# Altium schematic sheet Power.SchDoc: H-Watch Power
size A3; DrawnBy: schuluka; Organization: ETH-PBL; DocumentNumber: SCH3V0.2; Revision: V0.2; SheetNumber: 3; SheetTotal: 5
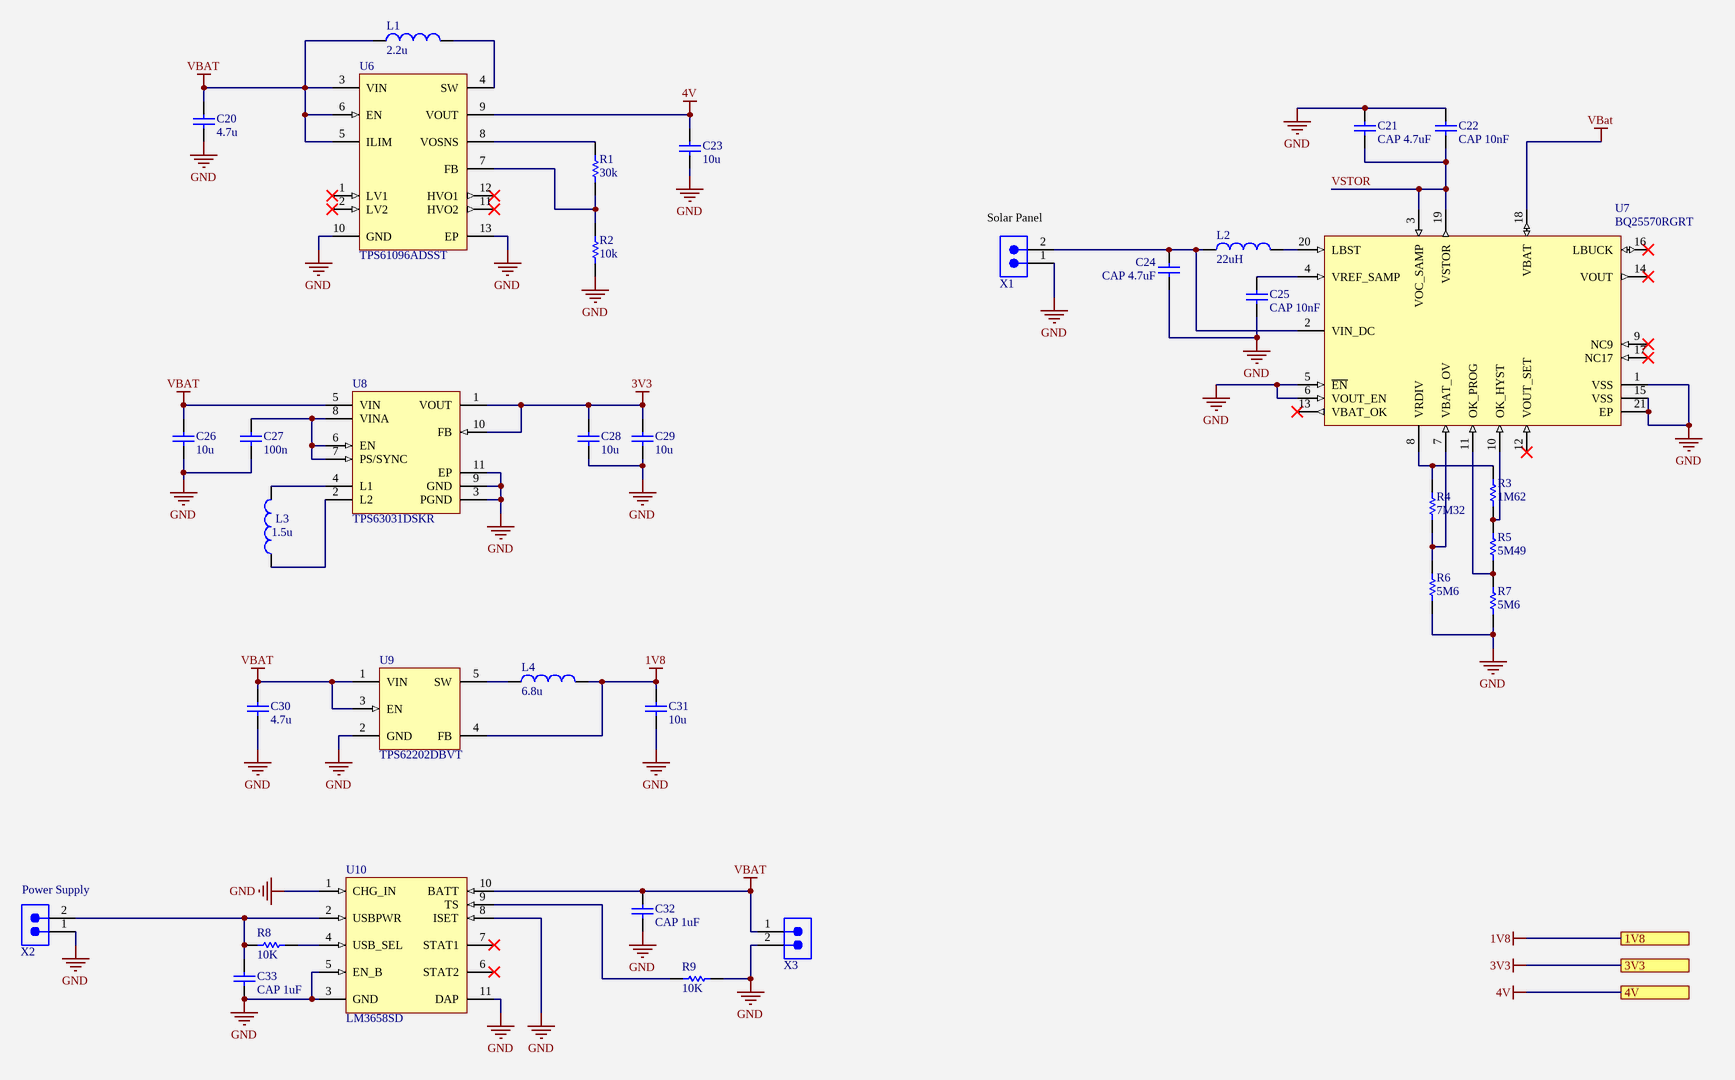
[diagram p0: Power.SchDoc]

## Parts
C20  4.7u  [CAPC1608X90X20ML10]
C21  CAP 4.7uF  [CAPC0603(1608)100_L]
C22  CAP 10nF  [CAPC0603(1608)100_L]
C23  10u  [CAPC1608X90X35NL10T15]
C24  CAP 4.7uF  [CAPC0603(1608)100_L]
C25  CAP 10nF  [CAPC0603(1608)100_L]
C26  10u  [CAPC1608X90X35NL10T15]
C27  100n  [CAPC1005X60X30ML05T10]
C28  10u  [CAPC1608X90X35NL10T15]
C29  10u  [CAPC1608X90X35NL10T15]
C30  4.7u  [CAPC1608X90X20ML10]
C31  10u  [CAPC1608X90X35NL10T15]
C32  CAP 1uF  [CAPC0603(1608)100_L]
C33  CAP 1uF  [CAPC0603(1608)100_L]
L1  2.2u  [INDC2013X140X50LL20T20]
L2  value 22uH  [INDC1210(3225)X27_L]  (hidden comment: CBC3225T220MR)
L3  1.5u  [COILCRAFT-IND-LPS3015]
L4  6.8u  [SUMI-CDRH5D28_V]
R1  30k  [RESC1005X40X25ML05T05]
R2  10k  [RESC1005X40X25LL05T05]
R3  1M62  [RESC0603(1608)_L]
R4  7M32  [RESC0603(1608)_L]
R5  5M49  [RESC0603(1608)_L]
R6  5M6  [RESC0603(1608)_L]
R7  5M6  [RESC0603(1608)_L]
R8  10K  [RESC0603(1608)_L]
R9  10K  [RESC0603(1608)_L]
U6  TPS61096ADSST  [SON50P200X80_HS-13N]
U7  BQ25570RGRT  [QFN50P350X350X100_HS-21L]
U8  TPS63031DSKR  [DSK10-2000X1200TP_V]
U9  TPS62202DBVT  [Z5+1_N]
U10  LM3658SD  [SDA10A]
X1  GRPB012VWVN-RC  [Pin Header, 1x2, TH]  (value not drawn)
X2  GRPB012VWVN-RC  [Pin Header, 1x2, TH]  (value not drawn)
X3  GRPB012VWVN-RC  [Pin Header, 1x2, TH]  (value not drawn)

## Ports
1V8, 3V3, 4V

## Nets
1V8: C31.2 L4.2 U9.4(FB) ; port 1V8
3V3: C28.2 C29.2 U8.1(VOUT) U8.10(FB) ; port 3V3
4V: C23.2 U6.9(VOUT) ; port 4V
GND: C20.1 C21.2 C22.2 C23.1 C24.1 C25.1 C26.1 C27.1 C28.1 C29.1 C30.1 C31.1 C32.1 C33.1 R2.1 R6.1 R7.1 R9.2 U6.10(GND) U6.13(EP) U7.1(VSS) U7.5(~{EN}) U7.6(VOUT_EN) U7.15(VSS) U7.21(EP) U8.3(PGND) U8.9(GND) U8.11(EP) U9.2(GND) U10.1(CHG_IN) U10.3(GND) U10.5(EN_B) U10.8(ISET) U10.11(DAP) X1.1 X2.1 X3.2
VBAT: C20.2 C26.2 C30.2 C32.2 L1.1 U6.3(VIN) U6.5(ILIM) U6.6(EN) U7.18(VBAT) U8.5(VIN) U9.1(VIN) U9.3(EN) U10.10(BATT) X3.1
VSTOR: C21.1 C22.1 U7.3(VOC_SAMP) U7.19(VSTOR)
NetC24_2: C24.2 L2.1 U7.2(VIN_DC) X1.2
NetC25_2: C25.2 U7.4(VREF_SAMP)
NetC27_2: C27.2 U8.6(EN) U8.7(PS/SYNC) U8.8(VINA)
NetC33_2: C33.2 R8.1 U10.2(USBPWR) X2.2
NetL1_2: L1.2 U6.4(SW)
NetL2_2: L2.2 U7.20(LBST)
NetL3_1: L3.1 U8.2(L2)
NetL3_2: L3.2 U8.4(L1)
NetL4_1: L4.1 U9.5(SW)
NetR1_1: R1.1 R2.2 U6.7(FB)
NetR1_2: R1.2 U6.8(VOSNS)
NetR3_1: R3.1 R5.2 U7.10(OK_HYST)
NetR3_2: R3.2 R4.2 U7.8(VRDIV)
NetR4_1: R4.1 R6.2 U7.7(VBAT_OV)
NetR5_1: R5.1 R7.2 U7.11(OK_PROG)
NetR8_2: R8.2 U10.4(USB_SEL)
NetR9_1: R9.1 U10.9(TS)

Not connected (* = marked no-connect by the designer): U6 1(LV1)* 2(LV2)* 11(HVO2)* 12(HVO1)*; U7 9(NC9)* 12(VOUT_SET)* 13(VBAT_OK)* 14(VOUT)* 16(LBUCK)* 17(NC17)*; U10 6(STAT2)* 7(STAT1)*

## Notes on the sheet
- (near X1) Solar Panel
- (near X2) Power Supply
- 1
- 2
- 3
- 4
- 5
- 6
- 7
- 8
- A
- B
- C
- D
- Project:
- Date:
- Drawing number:
- Rev:
- Format:
- A3
- Drawn by:
- Laboratory:
- Page
- Sheet:
- of
- File:

## Library data of the parts
C20 C30 = CMP-2000-04981-1: CAP, Ceramic, 4.7 uF, +/- 10%, 16 V, -55 to 85 degC, 0603 (1608 Metric), RoHS, Tape and Reel; Manufacturer: TDK; PCN Part Number: MLCCPartNumberChange30/Nov/2012; Other Names: 445-7478-1; Product Training Modules: CSeriesGeneralApplicationsSEAT,CCV,andTVCLDesignToolsGuidetoReplacinganElectrolyticCapacitorwithanMLCC; Design Resources: 20WNon-IsolatedBuckLEDDriverUsingPLLNK460KG; Online Catalog: CSeries,GeneralPurpose; Temperature Coefficient: X5R; Kits: 445-9003-KIT-ND-KITCAPCERHICAPMLCCSMD; Voltage - Rated: 16V; Capacitance: 4.7µF; Manufacturer URL: http://www.tdk.com/; Applications: GeneralPurpose; Height - Seated (Max): -; Mounting Type: SurfaceMount,MLCC; Lead Style: -; Packaging: CutTape(CT); Datasheet Version: Mar-15; Features: -; Ratings: -; Package / Case: 0603(1608Metric); Thickness (Max): 0.035"(0.90mm); Datasheet URL: http://download.siliconexpert.com/pdfs/2015/4/21/15/54/45/779/tdk_/manual/37024850441143360mlcc_commercial_general_en.pdf; Category: Capacitors; Family: CeramicCapacitors; Operating Temperature: -55degC~85degC; Size / Dimension: 0.063"Lx0.031"W(1.60mmx0.80mm); RoHS Information: RoHSCertificate-MLCC; Lead Spacing: -; Package Description: 2-Pin Surface Mount Device, Body 1.6 x 0.8 mm; Tolerance: ±10%; Series: C; Standard Package: 1; Package Reference: 603
C21 C24 = CMP-1035-02785-1: CAP 4.7uF 10V ±10% 0603 (1608 Metric) Thickness 1mm SMD; Tolerance: Â±10%; Case-EIA: 0603; Case-Metric: 1608; Max Thickness: 1 mm; Value: 4.7uF; Technology: SMT; Rated Voltage: 10 V
C22 C25 = CMP-1035-02304-1: CAP 10nF 10V ±2% 0603 (1608 Metric) Thickness 1mm SMD; Tolerance: Â±2%; Case-EIA: 0603; Case-Metric: 1608; Technology: SMT; Rated Voltage: 10 V; Value: 10nF; Max Thickness: 1 mm
C23 C26 C28 C29 C31 = CMP-2006-02792-1: Part Number: GRM188R60J106ME47D; Manufacturer: Murata
C27 = CMP-2008-02046-1: Manufacturer: Kemet; Part Number: C0402C104K8PACTU
C32 C33 = CMP-1035-02733-1: CAP 1uF 10V ±10% 0603 (1608 Metric) Thickness 1mm SMD; Tolerance: Â±10%; Case-EIA: 0603; Case-Metric: 1608; Rated Voltage: 10 V; Max Thickness: 1 mm; Value: 1uF; Technology: SMT
L1 = CMP-2000-05964-1: Wire-Wound Chip Power Inductor, 2.2 uH, +/- 20%, -40 to 105 degC, 2-Pin SMD (0805), RoHS, Tape and Reel; Manufacturer: Taiyo Yuden; Inductance: 2.2µH; Other Names: 587-2905-2 / LQBRC2012T2R2MD; Type: Wirewound; Current - Saturation: 1.1A; Online Catalog: BRSeries; EDA / CAD Models: DownloadfromAcceleratedDesigns; Shielding: Unshielded; DC Resistance (DCR): 143mOhmMax; Current Rating: 1A; Frequency - Test: 1MHz; Frequency - Self Resonant: 350MHz; Series: BR; Size / Dimension: 0.079"Lx0.049"W(2.00mmx1.25mm); Datasheet URL: http://ds.yuden.co.jp/TYCOMPAS/ut/detail.do?productNo=BRC2012T2R2MD&fileName=BRC2012T2R2MD_SS&mode=specSheetDownload; Tolerance: ±20%; Mounting Technology: SurfaceMount; Standard Package: 2,000; Category: Inductors,Coils,Chokes; Operating Temperature: -40°C~105°C; Mounting Type: SurfaceMount; Height - Seated (Max): 0.055"(1.40mm); Datasheet Version: 09/2016; Package Reference: 0805; Package Description: 2-Pin Surface Mount Device, Body 2 x 1.25 mm; Packaging: Tape&Reel(TR); Package / Case: 0805(2012Metric); Family: FixedInductors; Manufacturer URL: http://www.t-yuden.com/
L2 = CMP-01012-1: FIXED IND 22UH 780MA 351 MOHM; Core Material: Ferrite; Inductance Tolerance: 20%; Self Resonant Frequency: 17MHz; Saturation Current: 620mA; Shielding: Unshielded; DC Resistance (DCR): 351mR; Test Frequency: 100kHz; Mount: Surface Mount; Case/Package: 1210; Number of Pins: 2; Case Code (Metric): 3225; Case Code (Imperial): 1210; Min Operating Temperature: -40°C; Max Operating Temperature: 105°C; Current Rating: 780mA; Packaging: Tape and Reel; Package Quantity: 1000; Tolerance: 20%; Composition: Wirewound; Inductance: 22uh; Max DC Current: 780mA; Termination: SMD/SMT; DC Current: 780mA; Military Standard: Not; Length: 0.126inch; Height: 2.5mm; Width: 0.098inch; Height - Seated (Max): 0.106inch; Depth: 2.7mm; Radiation Hardening: No; REACH SVHC: Unknown; Lead Free: Lead Free; Halogen Free: Halogen Free
L3 = CMP-00861-1: INDUCTOR, SHLD, 1.5UH, 20%, 1.3A, SMD; Core Material: Ferrite; Saturation Current: 2.1A; DC Resistance (DCR): 100mR; Shielding: Shielded; Max DC Current: 2.2A; Self Resonant Frequency: 140MHz; Test Frequency: 100kHz; Weight: 0.001411oz; Min Operating Temperature: -40°C; Max Operating Temperature: 85°C; Inductance Tolerance: 20%; Packaging: Cut Tape; Inductance: 1.5uh; RMS Current (Irms): 1.3A; Termination: SMD/SMT; Tolerance: 20%; Package Quantity: 1; Length: 3mm; Height: 1.5mm; Width: 3mm; REACH SVHC: No SVHC
L4 = CMP-2000-06085-1: Power Inductor, 6.2 uH, +/- 30%, 1.8 A, -40 to 100 degC, 2-Pin SMD, RoHS, Tape and Reel; Manufacturer: Sumida; DC Resistance (DCR): 45mOhmMax; Frequency - Test: 100kHz; Product Training Modules: PowerInductorBasics; Other Names: 308-1542-1; Shielding: Shielded; Current Rating: 1.8A; Inductance: 6.2µH; Material - Core: Ferrite; Package Description: 2-Pin Surface Mount Device, Body 5.7 x 5.7 mm; Current - Saturation: -; Family: FixedInductors; Frequency - Self Resonant: -; Q @ Freq: -; Mounting Technology: SurfaceMount; Operating Temperature: -40°C~100°C; Package Reference: CDRH5D28; Datasheet Version: 01/2014; Tolerance: ±30%; Ratings: -; Size / Dimension: 0.224"Lx0.224"W(5.70mmx5.70mm); Category: Inductors,Coils,Chokes; Height - Seated (Max): 0.118"(3.00mm); Mounting Type: SurfaceMount; Packaging: CutTape(CT); Manufacturer URL: http://www.sumida.com/; Standard Package: 1; Datasheet URL: http://products.sumida.com/products/pdf/CDRH5D28.pdf; Package / Case: Nonstandard; Series: CDRH5D28; Type: -
R1 = CMP-2002-01142-1: Manufacturer: Panasonic; Part Number: ERJ-2RKF3002X
R2 = CMP-2000-07588-1: Chip Resistor, 10 KOhm, +/- 1%, 0.1 W, -55 to 155 degC, 0402 (1005 Metric), RoHS, Tape and Reel; Manufacturer: Panasonic; Power Rating: 100mW; Voltage Rating: 50V; Resistance: 10KOhm; Case\/Package: 0402; Temperature Coefficient: 100ppm\/degreesC; RoHSCompliant: True; Lead Free: LeadFree; Package Quantity: 1; Contact Plating: Tin; Length: 1mm; Radiation Hardening: No; REACH SVHC: NoSVHC; Max Operating Temperature: 155degC; Depth: 0.5mm; Case Code (Imperial): 0402; Military Standard: Not; Package Description: 2-Pin Surface Mount Device, Body 1 x 0.5 mm; Termination: SMD/SMT; Case Code (Metric): 1005; Height: 0.35mm; Packaging: TapeandReel; Voltage Rating (DC): 50V; Package Reference: 402; Number of Pins: 2; Tolerance: 1%; Mounting Technology: SurfaceMount; Width: 0.02inch; Mount: SurfaceMount; Datasheet URL: https://industrial.panasonic.com/cdbs/www-data/pdf/RDA0000/AOA0000C304.pdf; Composition: ThickFilm; Datasheet Version: 02/2017; Manufacturer URL: http://www.panasonic.com/; Max Power Dissipation: 100mW; Number of Terminations: 2; Min Operating Temperature: -55degC
R3 = CMP-1012-00871-1: 1M62 0.1W 1% 0603 (1608 Metric)  SMD; Case-EIA: 0603; Value: 1620000.00 Ohm; Case-Metric: 1608; Power: 0.1 W; Tolerance: 1 %; Technology: SMT
R4 = CMP-1012-00947-1: 7M32 0.1W 1% 0603 (1608 Metric)  SMD; Case-Metric: 1608; Value: 7320000.00 Ohm; Case-EIA: 0603; Technology: SMT; Power: 0.1 W; Tolerance: 1 %
R5 = CMP-1012-00933-1: 5M49 0.1W 1% 0603 (1608 Metric)  SMD; Value: 5490000.00 Ohm; Case-EIA: 0603; Case-Metric: 1608; Power: 0.1 W; Tolerance: 1 %; Technology: SMT
R6 R7 = CMP-1012-00934-1: 5M6 0.1W 1% 0603 (1608 Metric)  SMD; Case-Metric: 1608; Case-EIA: 0603; Value: 5600000.00 Ohm; Technology: SMT; Power: 0.1 W; Tolerance: 1 %
R8 R9 = CMP-1012-00623-1: 10K 0.1W 1% 0603 (1608 Metric)  SMD; Value: 10000.00 Ohm; Case-EIA: 0603; Case-Metric: 1608; Power: 0.1 W; Tolerance: 1 %; Technology: SMT
U6 = CMP-00875-1: Boost Switching Regulator IC Positive Fixed 3.3V, - 2 Output 350mA (Switch) 6-WFDFN; Manufacturer: Texas Instruments; Function: Step-Up; Output Type: Adjustable; Number of Outputs: 1; Voltage - Input (Min): 1.8V; Voltage - Input (Max): 5.5V; Voltage - Output (Min/Fixed): 4.5V; Voltage - Output (Max): 28V; Synchronous Rectifier: No; Category: Integrated Circuits (ICs); Family: PMIC - Voltage Regulators - DC DC Switching Regulators; Series: -; Packaging: Tape & Reel (TR); Part Status: Active; Output Configuration: Positive; Topology: Boost; Current - Output: 350mA (Switch); Frequency - Switching: -; Operating Temperature: -40°C ~ 150°C (TJ); Mounting Type: Surface Mount; Package / Case: 12-WFDFN Exposed Pad; Supplier Device Package: 12-WSON (3x2); Manufacturer Part Number: TPS61096ADSST; Supplier: Digikey; Supplier Part Number: 296-46930-1-ND; ComponentLink1Description: tps61096A.pdf; ComponentLink1URL: http://www.ti.com/lit/ds/symlink/tps61096a.pdf
U7 = CMP-00082-3: IC ENERGY HARV CTRLR BATT 20VQFN; Manufacturer: Texas Instruments; Current - Supply: 488nA; Voltage - Supply: 0.12 V ~ 4 V; Packaging: Tape & Reel (TR); Applications: Energy Harvesting; Operating Temperature: -40°C ~ 125°C; Mounting Type: Surface Mount; Package / Case: 20-VFQFN Exposed Pad; Supplier Device Package: 20-VQFN (3.5x3.5); P/N: BQ25570RGRT; Supplier: Digi-Key; Supplier Part Number: 296-37014-2-ND; ComponentLink1Description: bq25570.pdf; ComponentLink1URL: http://www.ti.com/lit/ds/symlink/bq25570.pdf
U8 = CMP-00866-1: Buck-Boost Switching Regulator IC Positive Fixed 3.3V 1 Output 900mA (Switch) 10-WFDFN Exposed Pad; Switching Frequency: 2.4MHz; Output Current: 800mA; Min Input Voltage: 1.8V; Number of Outputs: 1; Max Input Voltage: 5.5V; Efficiency: 96%; Synchronous Rectifier: Yes; Quiescent Current: 25uA; Mount: Surface Mount; Number of Pins: 10; Contact Plating: Gold; Min Operating Temperature: -40°C; Max Operating Temperature: 85°C; Output Voltage: 3.3V; Packaging: Tape and Reel; Package Quantity: 3000; Max Output Current: 800mA; Min Output Voltage: 3.3V; Nominal Output Voltage: 3.3V; Topology: Buck-Boost; Operating Supply Voltage: 5.5V; Radiation Hardening: No; REACH SVHC: No SVHC; Lead Free: Lead Free
U9 = CMP-00865-1: Buck Switching Regulator IC Positive Fixed 1.8V 1 Output 300mA SOT-23; Number of Outputs: 1; Frequency: 1MHz; Max Input Voltage: 6V; Min Supply Voltage: 2.5V; Efficiency: 95%; Synchronous Rectifier: Yes; Output Power: 357mW; Quiescent Current: 15uA; Mount: Surface Mount; Case/Package: SOT-23; Number of Pins: 5; Min Operating Temperature: -40°C; Max Operating Temperature: 85°C; Packaging: Tape and Reel; Output Voltage: 1.8V; Output Current: 300mA; Max Output Current: 300mA; Max Supply Voltage: 6V; Package Quantity: 1; Min Input Voltage: 2.5V; Nominal Output Voltage: 1.8V; Switching Frequency: 1MHz; Min Output Voltage: 1.8V; Max Output Voltage: 1.8V; Termination: SMD/SMT; Length: 2.9mm; Height: 1.15mm; Width: 1.6mm; Radiation Hardening: No; REACH SVHC: No SVHC; Lead Free: Lead Free
U10 = CMP-0063-00779-2: Dual Source USB/AC Li Chemistry Charger IC for Portable Applications, 10-pin LLP; Manufacturer: National Semiconductor; CompType: MiscPower; PackageTopMarking: ZXYTT*L111B; PowerWise: N; PackageReference: SDA10A; DatasheetVersion: Nov-2006; ComponentLink2Description: LM3658 Web Page; ComponentLink3URL: http://www.national.com/packaging/folders/sda10a.html; ComponentLink1Description: LM3658 Datasheet; ComponentLink2URL: http://www.national.com/pf/LM/LM3658.html; ComponentLink1URL: http://www.national.com/ds/LM/LM3658.pdf; RevisionNote: Component URLs added; PackageVersion: revA, Oct-2003; ComponentLink3Description: SDA10A Package Page; RoHS: N; PinCount: 10; PackageDescription: LLP, Plastic, Dual, 3 x 3 x 0.8mm Body, 10 Lead, 0.5mm Pitch, No Pullback
X1-X3 = CMP-00149-1: CONN HEADER 1.27mm Pitch 1x2 POS TH DL PCB AU; Manufacturer: Sullins Connector Solutions; Connector Type: Header, Unshrouded; Number of Positions: 2; Number of Positions Loaded: All; Packaging: Bulk; Contact Type: Male Pin; Pitch: -; Number of Rows: 2; Mounting Type: Through Hole; Termination: Solder; Fastening Type: -; Features: -; Contact Finish: Gold; Contact Finish Thickness: Flash; Color: -; Manufacturer Part Number: GRPB012VWVN-RC; Supplier: Digi-Key; Supplier Part Number: S9015E-01-ND; ComponentLink1Description: GRPB_%20_2VWVN-RC%2010954-C.pdf; ComponentLink1URL: http://media.digikey.com/pdf/Data%20Sheets/Sullins%20PDFs/GRPB_%20_2VWVN-RC%2010954-C.pdf